# EAGLE design EXP_GameDuino_V1 (EAGLE 9.6.2)
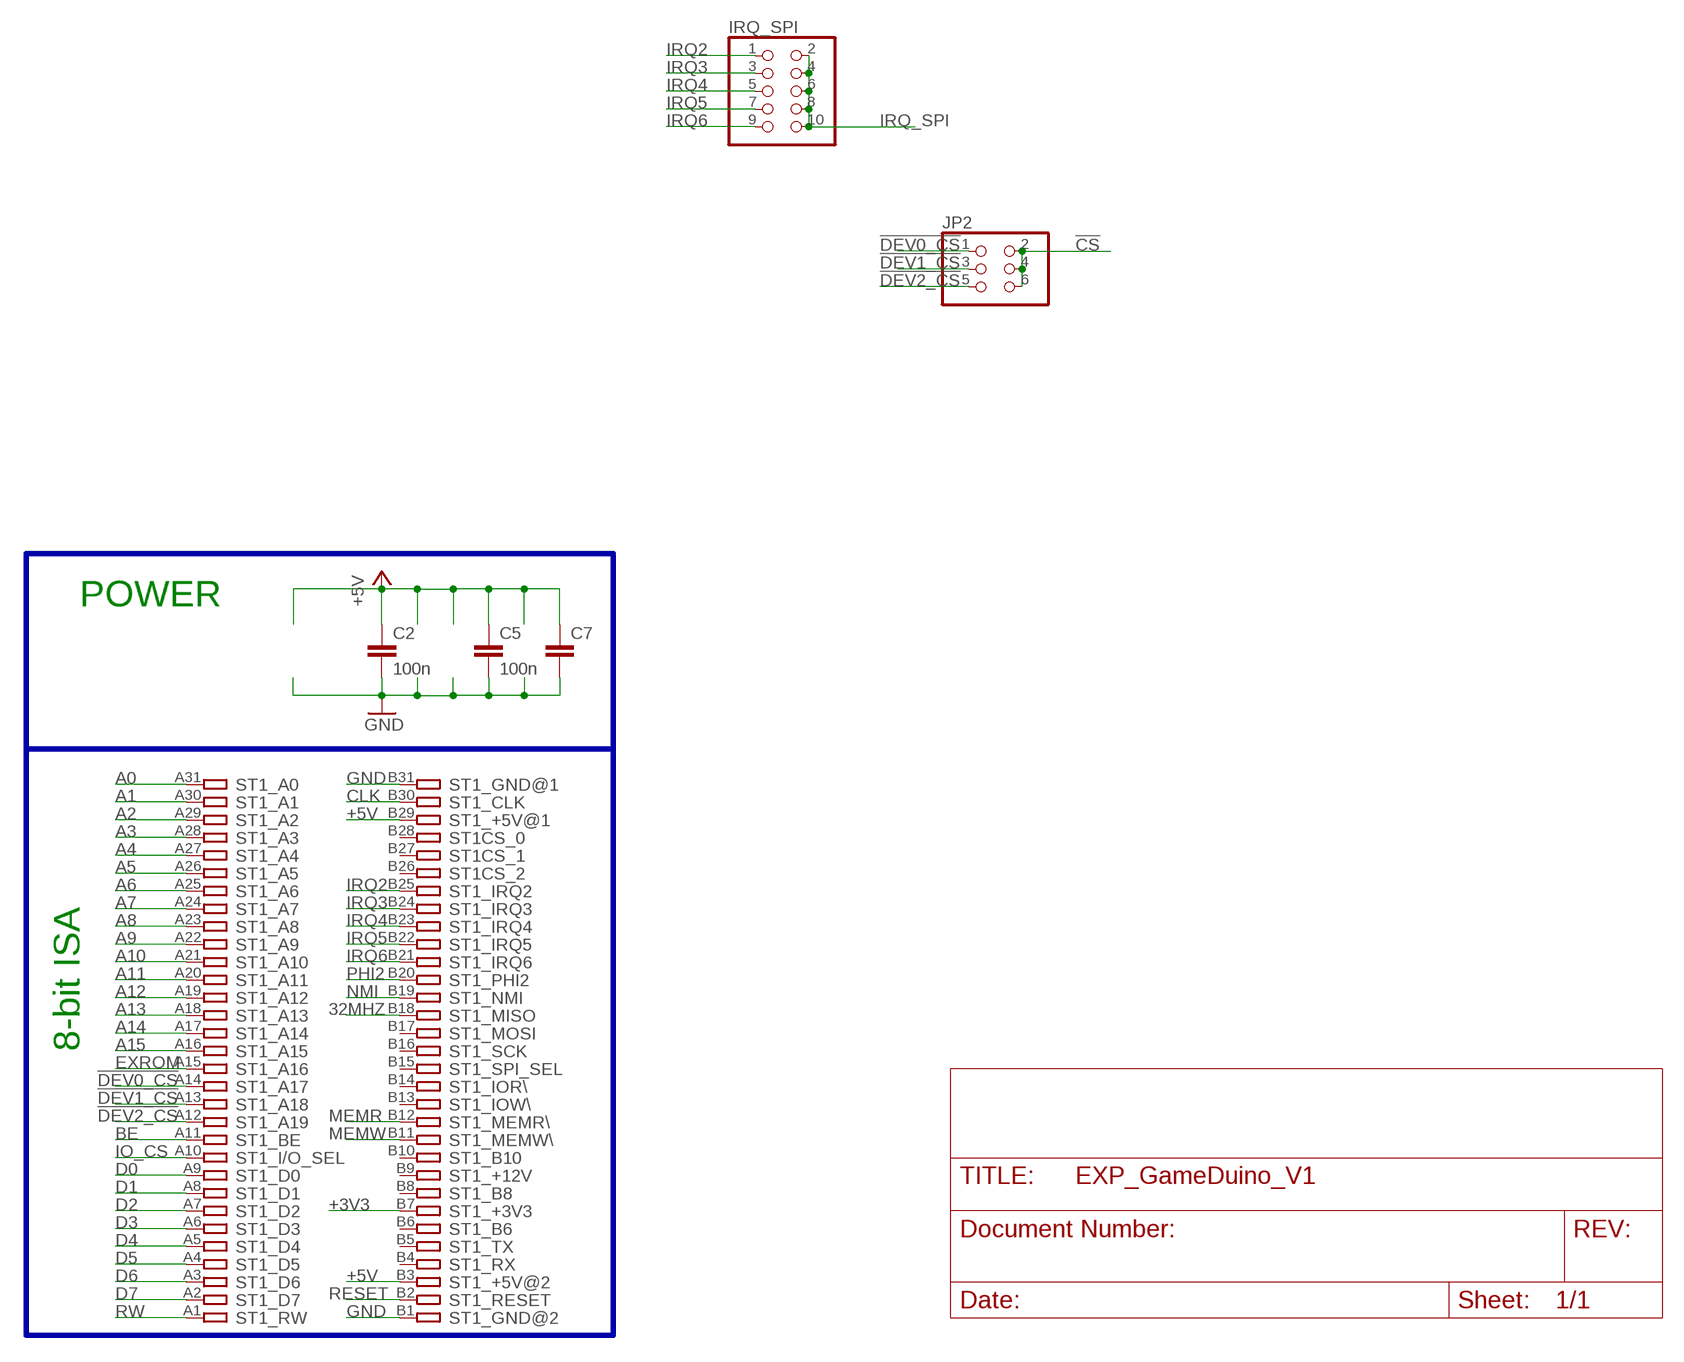
[diagram p0: schematic, sheet 1, part 1 of 2]
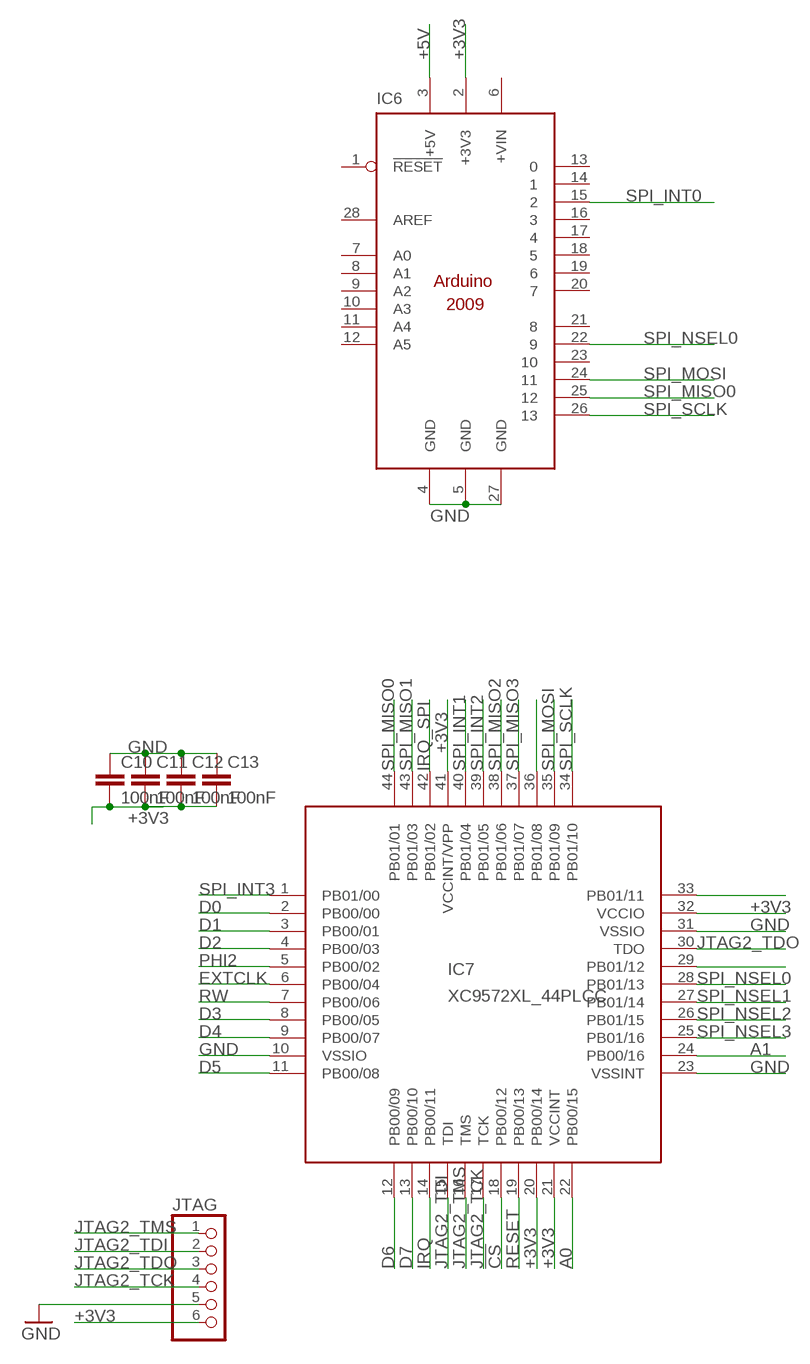
[diagram p1: schematic, sheet 1, part 2 of 2]

## Parts
C2  100n  C-EU050-025X075  [C050-025X075]
C5  100n  C-EU050-025X075  [C050-025X075]
C7  C-EU050-035X075  [C050-035X075]
C10  100nF  CAPC603  [C603]
C11  100nF  CAPC603  [C603]
C12  100nF  CAPC603  [C603]
C13  100nF  CAPC603  [C603]
IC6  ARDUINO2009_10  [ARDUINO2009]
IC7  XC9572XL_44PLCC  XC9536_44PLCCPLCC44_THT  [S44]
IRQ_SPI  PINHD-2X5  [2X05]
JP2  PINHD-2X3  [2X03]
JTAG  PINHD-1X6  [1X06]
ST1  IBM8BIT_ISASHORT  [APP_2X32_SHORT]

## Nets
32MHZ: ST1.B18
!CS: IC7.18(PB00/12) JP2.2 JP2.4 JP2.6
!DEV0_CS: JP2.1 ST1.A14
!DEV1_CS: JP2.3 ST1.A13
!DEV2_CS: JP2.5 ST1.A12
+3V3: C10.2 C11.2 C12.2 C13.2 IC6.2(+3V3) IC7.20(PB00/14) IC7.21(VCCINT) IC7.32(VCCIO) IC7.41(VCCINT/VPP) JTAG.6 ST1.B7
+5V [power]: C2.1 C5.1 C7.1 IC6.3(+5V) ST1.B3 ST1.B29
A0: IC7.22(PB00/15) ST1.A31
A1: IC7.24(PB00/16) ST1.A30
A2: ST1.A29
A3: ST1.A28
A4: ST1.A27
A5: ST1.A26
A6: ST1.A25
A7: ST1.A24
A8: ST1.A23
A9: ST1.A22
A10: ST1.A21
A11: ST1.A20
A12: ST1.A19
A13: ST1.A18
A14: ST1.A17
A15: ST1.A16
BE: ST1.A11
CLK: ST1.B30
D0: IC7.2(PB00/00) ST1.A9
D1: IC7.3(PB00/01) ST1.A8
D2: IC7.4(PB00/03) ST1.A7
D3: IC7.8(PB00/05) ST1.A6
D4: IC7.9(PB00/07) ST1.A5
D5: IC7.11(PB00/08) ST1.A4
D6: IC7.12(PB00/09) ST1.A3
D7: IC7.13(PB00/10) ST1.A2
EXROM: ST1.A15
EXTCLK: IC7.6(PB00/04)
GND [power]: C2.2 C5.2 C7.2 C10.1 C11.1 C12.1 C13.1 IC6.4(GND) IC6.5(GND) IC6.27(GND) IC7.10(VSSIO) IC7.23(VSSINT) IC7.31(VSSIO) JTAG.5 ST1.B1 ST1.B31
IO_CS: ST1.A10
IRQ: IC7.14(PB00/11)
IRQ2: IRQ_SPI.1 ST1.B25
IRQ3: IRQ_SPI.3 ST1.B24
IRQ4: IRQ_SPI.5 ST1.B23
IRQ5: IRQ_SPI.7 ST1.B22
IRQ6: IRQ_SPI.9 ST1.B21
IRQ_SPI: IC7.42(PB01/02) IRQ_SPI.2 IRQ_SPI.4 IRQ_SPI.6 IRQ_SPI.8 IRQ_SPI.10
JTAG2_TCK: IC7.17(TCK) JTAG.4
JTAG2_TDI: IC7.15(TDI) JTAG.2
JTAG2_TDO: IC7.30(TDO) JTAG.3
JTAG2_TMS: IC7.16(TMS) JTAG.1
MEMR: ST1.B12
MEMW: ST1.B11
N$29: IC7.29(PB01/12)
N$33: IC7.33(PB01/11)
N$36: IC7.36(PB01/08)
NMI: ST1.B19
PHI2: IC7.5(PB00/02) ST1.B20
RESET: IC7.19(PB00/13) ST1.B2
RW: IC7.7(PB00/06) ST1.A1
SPI_INT0: IC6.15
SPI_INT1: IC7.40(PB01/04)
SPI_INT2: IC7.39(PB01/05)
SPI_INT3: IC7.1(PB01/00)
SPI_MISO0: IC6.25 IC7.44(PB01/01)
SPI_MISO1: IC7.43(PB01/03)
SPI_MISO2: IC7.38(PB01/06)
SPI_MISO3: IC7.37(PB01/07)
SPI_MOSI: IC6.24 IC7.35(PB01/09)
SPI_NSEL0: IC6.22 IC7.28(PB01/13)
SPI_NSEL1: IC7.27(PB01/14)
SPI_NSEL2: IC7.26(PB01/15)
SPI_NSEL3: IC7.25(PB01/16)
SPI_SCLK: IC6.26 IC7.34(PB01/10)
Unconnected: IC6.1(!RESET) IC6.6(+VIN) IC6.7(A0) IC6.8(A1) IC6.9(A2) IC6.10(A3) IC6.11(A4) IC6.12(A5) IC6.13 IC6.14 IC6.16 IC6.17 IC6.18 IC6.19 IC6.20 IC6.21 IC6.23 IC6.28(AREF) ST1.B4 ST1.B5 ST1.B6 ST1.B8 ST1.B9 ST1.B10 ST1.B13 ST1.B14 ST1.B15 ST1.B16 ST1.B17 ST1.B26 ST1.B27 ST1.B28

## Buses
A8,A9,A10,A11,ACIA_CS,IO_CS,IO_CS_N,MOR

## Notes on the sheet
- POWER
- 8-bit ISA

## Library data of the parts
C2 C5 = rcl:C-EU: CAPACITOR, European symbol
C7 = rcl:C-EU: CAPACITOR, European symbol; SPICEPREFIX: C
C10-C13 = dp_devices:CAP
IC6 = arduino:ARDUINO2009_1: The Arduino Duemilanove ("2009") is a microcontroller board based on the ATmega168 or ATmega328. - 14 digital input/output pins (of which 6 can be used as PWM outputs) - 6 analog inputs, a 16 MHz crystal oscillator - USB connection - power jack - ISP header - reset button It contains everything needed to support the microcontroller; simply connect it to a computer with a USB cable or power it with a AC-to-DC adapter or battery to get started http://arduino.cc/en/Main/ArduinoBoardDuemilanove
IC7 = Xilinx_tirorin:XC9536_44PLCC: xc9536_pc44 XC9500 In-System Programmable CPLD Family Auto generated by make-symbol-device-package-bsdl.ulp Rev. 34 Source: xc9536_pc44.bsd
IRQ_SPI = pinhead:PINHD-2X5: PIN HEADER
JP2 = pinhead:PINHD-2X3: PIN HEADER
JTAG = pinhead:PINHD-1X6: PIN HEADER
ST1 = TiRoRiN_Libs:IBM8BIT_ISA: 8-bit CARD IBM/PC-AT

## Net classes
0 default: width 0.254 mm, drill 0.2 mm, clearance 0.254 mm
1 power: width 0.254 mm, drill 0.66 mm, clearance 0.254 mm to class 0, clearance 0.254 mm
2 data: width 0.254 mm, drill 0.66 mm, clearance 0.254 mm to class 0, clearance 0.254 mm to class 1, clearance 0.254 mm

## Board
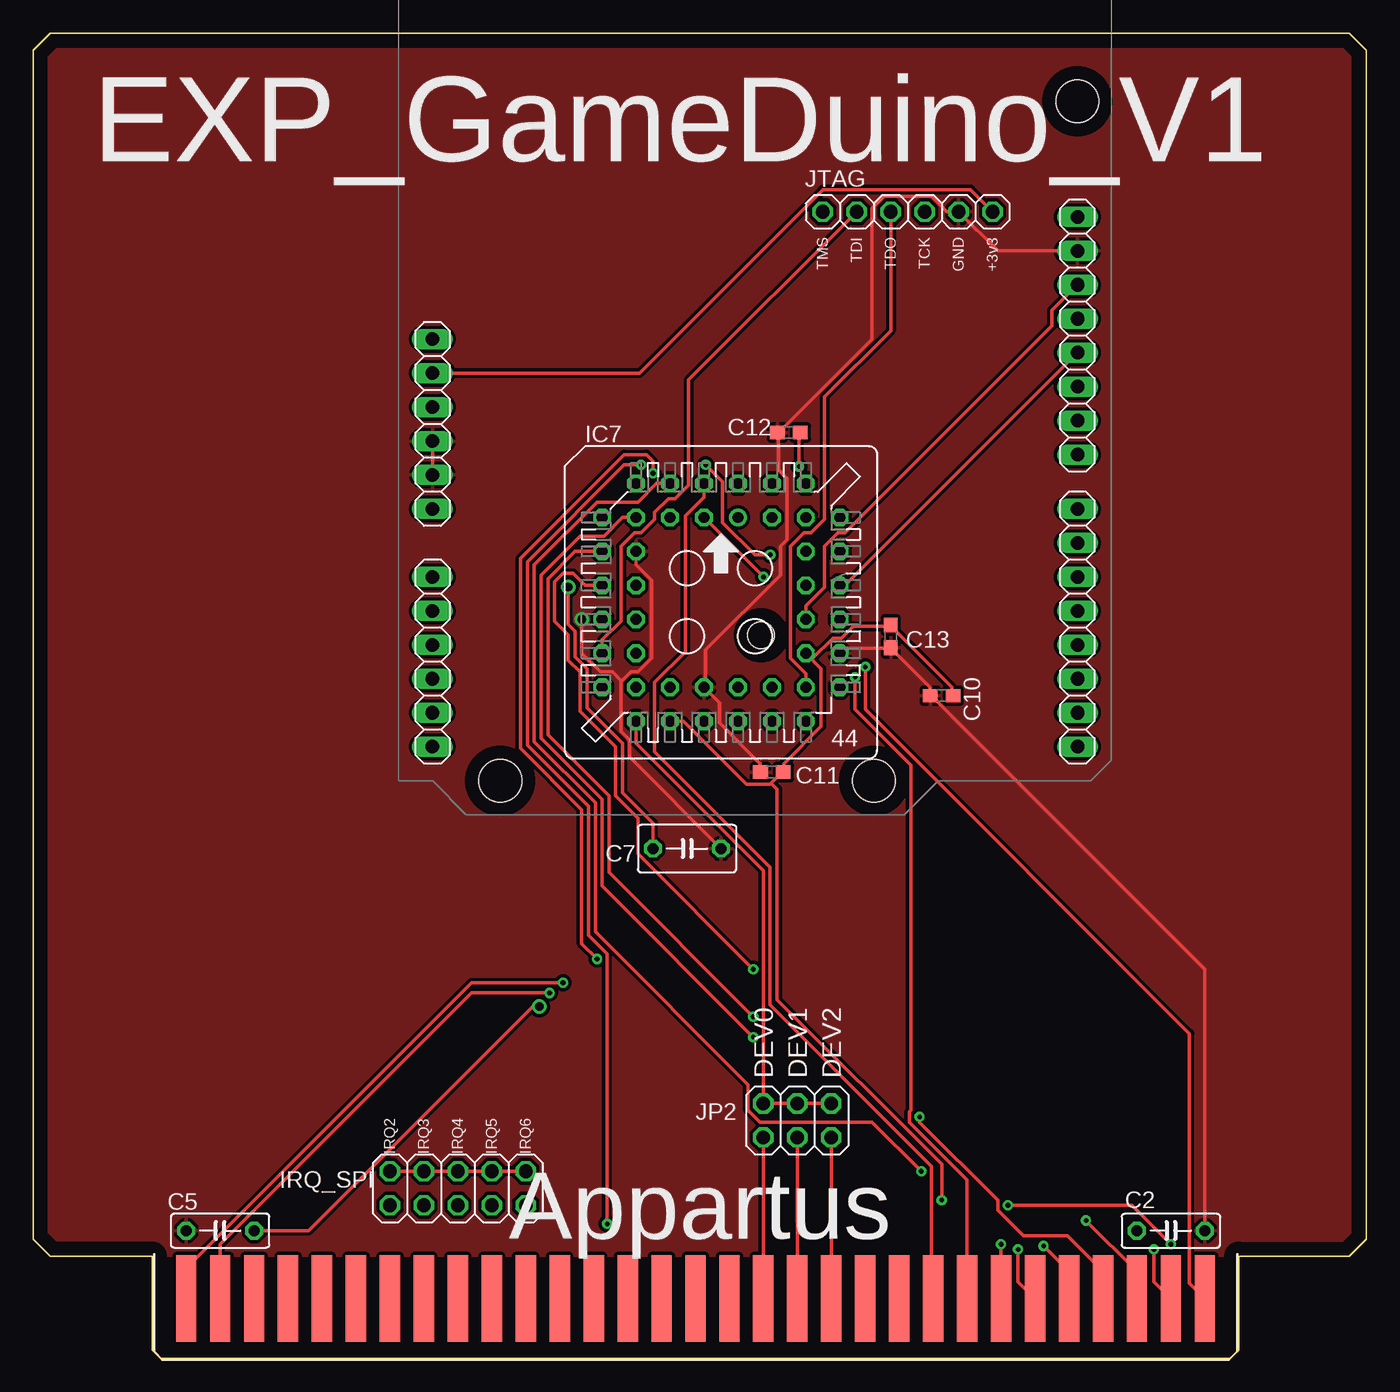
[diagram p2: board, top side]
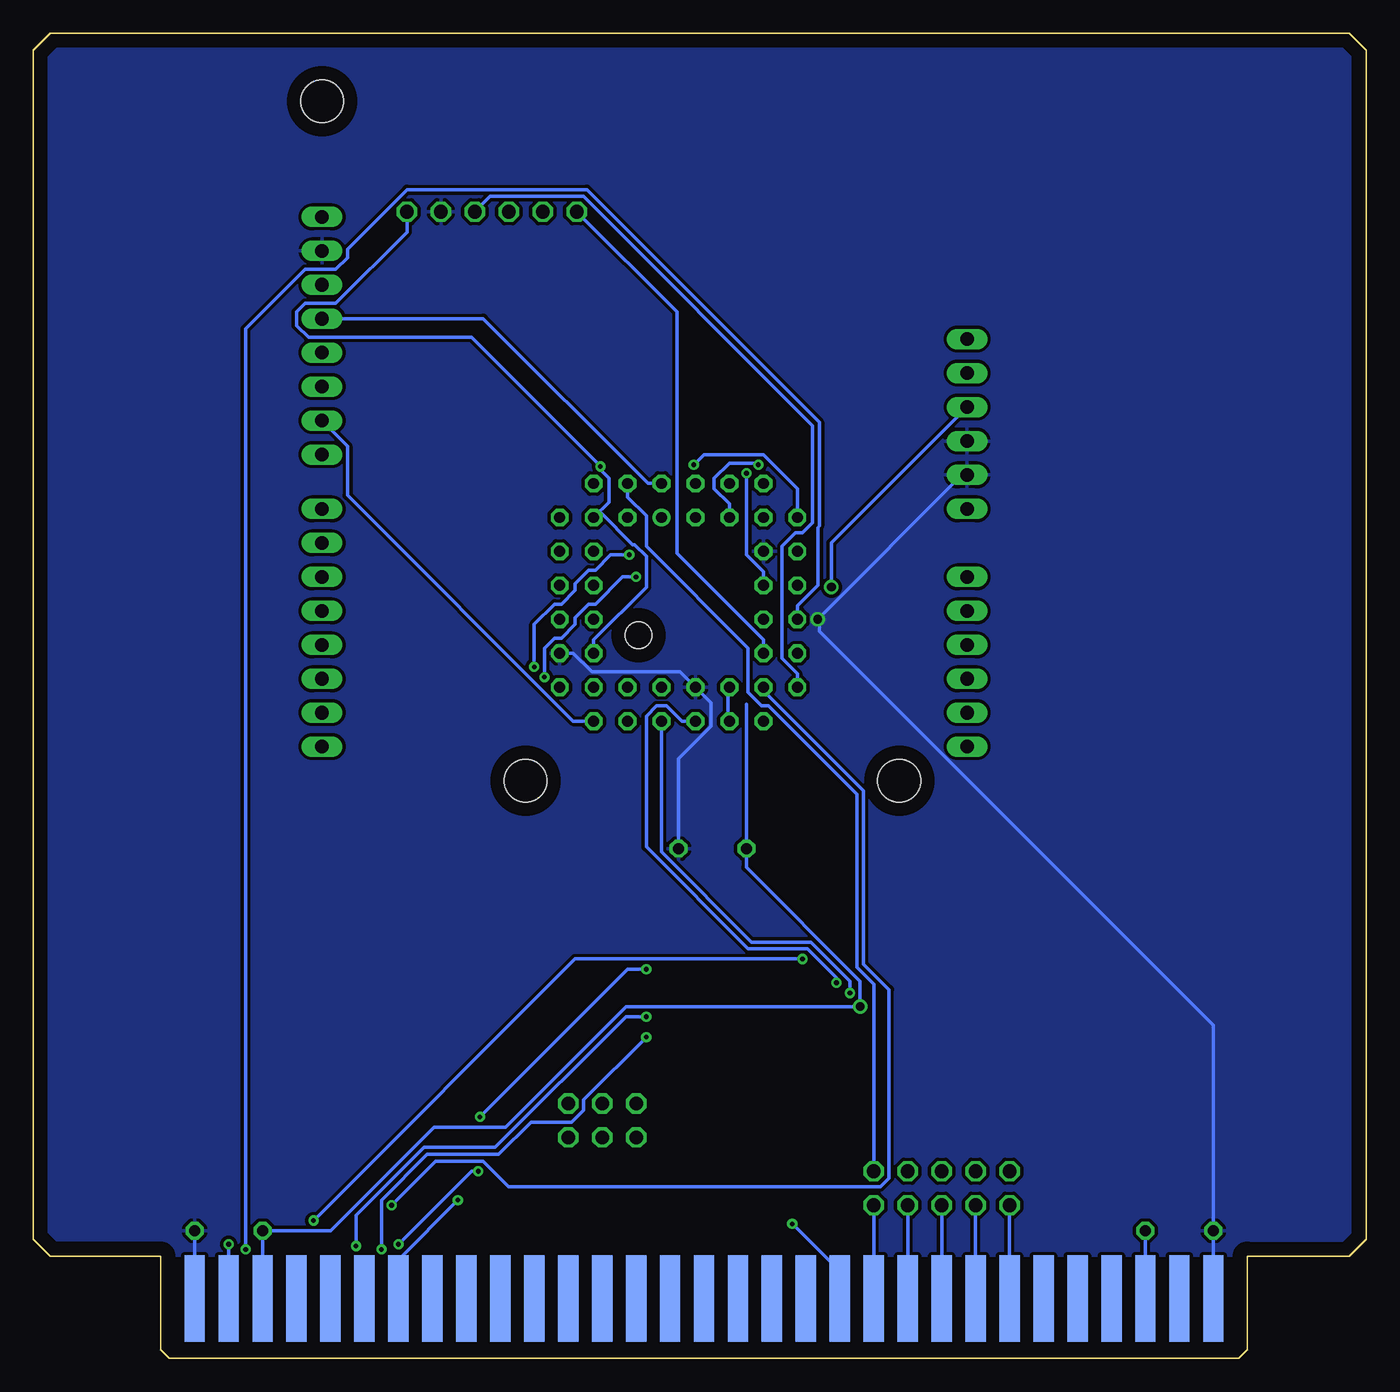
[diagram p3: board, bottom side, seen from below]

Size 99.7 x 99.06 mm. Coordinates in mm from the lower left corner, seen from the top.
Copper layers (1*16): Top 0.035mm / dielectric 1.5mm / Bottom 0.035mm
Design rules "appartus": minimum track width 6mil, minimum drill 0.35mm, track to track 6mil, track to pad 6mil, pad to pad 6mil, via to via 6mil, smd to smd 6mil, copper to edge 40mil, drill to drill 6mil, minimum pad ring 10mil, minimum via ring 8mil, stop-mask expansion 4mil, vias tented up to drill 0mil, thermal gap 10mil

### Footprints (pad centres in the part's own frame; a part is rotated, then mirrored left to right if it is on the bottom)
C050-025X075 = drill 0.813 octagon: 1 -2.54,0; 2 2.54,0
C050-035X075 = drill 0.813 octagon: 1 -2.54,0; 2 2.54,0
C603 = smd 1.1 x 1: 1 -0.85,0; 2 0.85,0
ARDUINO2009 = drill 1.016 long: 1 33.02,2.54; 2 35.56,2.54; 3 38.1,2.54; 4 40.64,2.54; 5 43.18,2.54; 6 45.72,2.54; 7 50.8,2.54; 8 53.34,2.54; 9 55.88,2.54; 10 58.42,2.54; 11 60.96,2.54; 12 63.5,2.54; 13 63.5,50.8; 14 60.96,50.8; 15 58.42,50.8; 16 55.88,50.8; 17 53.34,50.8; 18 50.8,50.8; 19 48.26,50.8; 20 45.72,50.8; 21 41.656,50.8; 22 39.116,50.8; 23 36.576,50.8; 24 34.036,50.8; 25 31.496,50.8; 26 28.956,50.8; 27 26.416,50.8; 28 23.876,50.8 | hole 3.2: 15.24,50.8; 66.04,35.56; 66.04,7.62 | hole 2: 55.17,27.114
S44 = drill 0.813: 1 1.27,6.35 | drill 0.813 octagon: 2 -1.27,8.89; 3 -1.27,6.35; 4 -3.81,8.89; 5 -3.81,6.35; 6 -6.35,8.89; 7 -8.89,6.35; 8 -6.35,6.35; 9 -8.89,3.81; 10 -6.35,3.81; 11 -8.89,1.27; 12 -6.35,1.27; 13 -8.89,-1.27; 14 -6.35,-1.27; 15 -8.89,-3.81; 16 -6.35,-3.81; 17 -8.89,-6.35; 18 -6.35,-8.89; 19 -6.35,-6.35; 20 -3.81,-8.89; 21 -3.81,-6.35; 22 -1.27,-8.89; 23 -1.27,-6.35; 24 1.27,-8.89; 25 1.27,-6.35; 26 3.81,-8.89; 27 3.81,-6.35; 28 6.35,-8.89; 29 8.89,-6.35; 30 6.35,-6.35; 31 8.89,-3.81; 32 6.35,-3.81; 33 8.89,-1.27; 34 6.35,-1.27; 35 8.89,1.27; 36 6.35,1.27; 37 8.89,3.81; 38 6.35,3.81; 39 8.89,6.35; 40 6.35,8.89; 41 6.35,6.35; 42 3.81,8.89; 43 3.81,6.35; 44 1.27,8.89
2X05 = drill 1.016 octagon: 1 -5.08,-1.27; 2 -5.08,1.27; 3 -2.54,-1.27; 4 -2.54,1.27; 5 0,-1.27; 6 0,1.27; 7 2.54,-1.27; 8 2.54,1.27; 9 5.08,-1.27; 10 5.08,1.27
2X03 = drill 1.016 octagon: 1 -2.54,-1.27; 2 -2.54,1.27; 3 0,-1.27; 4 0,1.27; 5 2.54,-1.27; 6 2.54,1.27
1X06 = drill 1.016 octagon: 1 -6.35,0; 2 -3.81,0; 3 -1.27,0; 4 1.27,0; 5 3.81,0; 6 6.35,0
APP_2X32_SHORT = smd 1.524 x 6.477: A1 38.1,-44.45; A2 35.56,-44.45; A3 33.02,-44.45; A4 30.48,-44.45; A5 27.94,-44.45; A6 25.4,-44.45; A7 22.86,-44.45; A8 20.32,-44.45; A9 17.78,-44.45; A10 15.24,-44.45; A11 12.7,-44.45; A12 10.16,-44.45; A13 7.62,-44.45; A14 5.08,-44.45; A15 2.54,-44.45; A16 0,-44.45; A17 -2.54,-44.45; A18 -5.08,-44.45; A19 -7.62,-44.45; A20 -10.16,-44.45; A21 -12.7,-44.45; A22 -15.24,-44.45; A23 -17.78,-44.45; A24 -20.32,-44.45; A25 -22.86,-44.45; A26 -25.4,-44.45; A27 -27.94,-44.45; A28 -30.48,-44.45; A29 -33.02,-44.45; A30 -35.56,-44.45; A31 -38.1,-44.45 | smd 1.524 x 6.477 bottom: B1 38.1,-44.45; B2 35.56,-44.45; B3 33.02,-44.45; B4 30.48,-44.45; B5 27.94,-44.45; B6 25.4,-44.45; B7 22.86,-44.45; B8 20.32,-44.45; B9 17.78,-44.45; B10 15.24,-44.45; B11 12.7,-44.45; B12 10.16,-44.45; B13 7.62,-44.45; B14 5.08,-44.45; B15 2.54,-44.45; B16 0,-44.45; B17 -2.54,-44.45; B18 -5.08,-44.45; B19 -7.62,-44.45; B20 -10.16,-44.45; B21 -12.7,-44.45; B22 -15.24,-44.45; B23 -17.78,-44.45; B24 -20.32,-44.45; B25 -22.86,-44.45; B26 -25.4,-44.45; B27 -27.94,-44.45; B28 -30.48,-44.45; B29 -33.02,-44.45; B30 -35.56,-44.45; B31 -38.1,-44.45

### Placement (x,y rotation side)
C2  85.09,9.53 0 top
C5  13.97,9.53 180 top
C7  48.9,38.1 0 top
C10  67.95,49.53 0 top
C11  55.25,43.82 0 top
C12  56.52,69.22 0 top
C13  64.14,53.98 90 top
IC6  27.31,109.22 270 top
IC7  51.44,56.52 0 top
IRQ_SPI  31.75,12.7 0 top
JP2  57.15,17.78 0 top
JTAG  65.41,85.73 0 top
ST1  49.53,48.9 0 top

### Tracks (layer width: path | path; a pad name or v marks a point on that pad's centre or on a via)
!CS
  Top 0.254: IC7.18 45.09,45.97 54.61,36.45 JP2.2 JP2.4 JP2.6
!DEV0_CS
  Top 0.254: ST1.A14 JP2.1
!DEV1_CS
  Top 0.254: ST1.A13 JP2.3
!DEV2_CS
  Top 0.254: ST1.A12 JP2.5
+3V3  (via drill 0.35)
  Top 0.254: IC6.2 45.34,73.66 59.06,87.38 70.1,87.38 JTAG.6 | v57.28,66.68 57.28,69.22 C12.2 | 64.14,54.74 61.34,54.74 60.45,53.85 59.82,53.85 58.29,52.32 IC7.32 58.93,51.56 58.93,47.24 56.13,44.45 56.13,43.82 C11.2 56.01,43.82 55.18,42.99 | 64.14,54.74 68.71,50.17 68.71,49.53 C10.2 | 64.14,54.74 C13.2 | IC7.20 48.64,47.63 53.34,42.93 55.12,42.93 55.18,42.99 | v67.95,11.81 67.95,14.48 55.63,26.8 55.63,42.55 55.18,42.99
  Bottom 0.254: IC7.32 57.79,53.72 53.85,57.66 53.85,59.94 54.74,60.83 54.86,60.83 57.28,63.25 IC7.41 56.64,64.01 56.64,65.79 57.28,66.42 v57.28,66.68 66.93,76.33 79.12,76.33 80.01,77.22 80.01,78.23 79.38,78.87 77.09,78.87 71.76,84.2 JTAG.6 | ST1.B7 72.39,7.37 v67.95,11.81 | IC7.21 47.73,49.99 47.73,47.74 IC7.20
+5V  (via drill 0.66)
  Top 0.254: v40.01,57.66 40.01,54.86 40.51,54.36 40.51,52.45 41.4,51.56 41.4,48.64 44.07,45.97 44.07,42.29 46.36,40.01 C7.1 | C5.1 20.57,9.53 37.34,26.29 v37.85,26.29
  Bottom 0.254: ST1.B3 C2.1 77.47,9.53 69.72,17.27 64.39,17.27 55.37,26.29 v37.85,26.29 37.85,28.19 46.36,36.7 C7.1 46.36,48.9 | ST1.B29 C5.1 | IC6.3 40.01,60.96 v40.01,57.66
A0  (via drill 0.35)
  Top 0.254: v39.62,28.07 32.77,28.07 11.43,6.73 ST1.A31
  Bottom 0.254: IC7.22 51.18,47.63 52.32,48.77 53.09,48.77 53.85,48.01 53.85,38.23 46.23,30.61 41.78,30.61 39.62,28.45 v39.62,28.07
A1  (via drill 0.35)
  Top 0.254: v38.61,27.31 32.77,27.31 13.97,8.51 ST1.A30
  Bottom 0.254: IC7.24 52.71,37.85 45.97,31.12 41.53,31.12 38.61,28.19 v38.61,27.31
D0
  Top 0.254: IC7.2 50.17,64.39 48.77,62.99 48.77,52.83 46.48,50.55 46.48,45.34 55.12,36.7 55.12,26.42 67.18,14.35 67.18,4.57 ST1.A9
D1  (via drill 0.35)
  Top 0.254: v54.61,58.42 IC7.3 | v61.47,50.93 61.47,48.51 65.66,44.32 65.66,18.54 65.53,18.42 65.53,17.65 69.85,13.34 ST1.A8
  Bottom 0.254: v54.61,58.42 55.63,58.42 57.66,56.39 58.17,56.39 59.18,55.37 59.18,54.86 60.2,53.85 60.71,53.85 61.47,53.09 v61.47,50.93
D2  (via drill 0.35)
  Top 0.254: IC7.4 46.61,65.41 45.21,64.01 42.16,64.01 37.47,59.31 37.47,46.1 42.04,41.53 42.04,31.88 53.47,20.45 53.47,18.54 54.36,17.65 62.74,17.65 v66.42,13.97 | ST1.A7 v72.39,8.51
  Bottom 0.254: v66.42,13.97 66.93,13.97 v72.39,8.51
D3  (via drill 0.35)
  Top 0.254: IC7.8 44.07,62.87 42.67,61.47 40.89,61.47 37.97,58.55 37.97,46.36 42.55,41.78 42.55,35.31 v53.85,24 | v73.66,8.13 73.66,5.72 ST1.A6
  Bottom 0.254: v53.85,24 58.55,19.3 58.55,18.54 59.44,17.65 62.48,17.65 64.9,15.24 70.23,15.24 73.66,11.81 v73.66,8.13
D4  (via drill 0.35)
  Top 0.254: IC7.9 40.51,60.33 38.48,58.29 38.48,46.61 43.05,42.04 43.05,36.32 v53.85,25.53 | v75.56,8.38 77.47,6.48 ST1.A5
  Bottom 0.254: v53.85,25.53 55.37,25.53 65.15,15.75 70.48,15.75 75.56,10.67 v75.56,8.38
D5  (via drill 0.35)
  Top 0.254: IC7.11 41.28,57.79 40.39,58.67 39.62,58.67 38.99,58.04 38.99,55.12 40.01,54.1 40.01,52.2 40.89,51.31 40.89,48.39 43.56,45.72 43.56,42.04 45.21,40.39 45.21,37.72 v53.85,29.08 | v66.29,18.03 66.29,17.65 72.14,11.81 72.14,11.05 74.04,9.14 77.34,9.14 80.01,6.48 ST1.A4
  Bottom 0.254: v53.85,29.08 55.25,29.08 v66.29,18.03
D6  (via drill 0.35)
  Top 0.254: v46.36,66.17 46.36,67.06 45.85,67.56 44.2,67.56 36.45,59.82 36.45,45.59 41.02,41.02 41.02,30.99 v42.16,29.85 | v78.74,10.29 82.55,6.48 ST1.A3
  Bottom 0.254: IC7.12 45.09,58.8 46.36,60.07 v46.36,66.17 | v42.16,29.85 59.18,29.85 v78.74,10.29
D7  (via drill 0.35)
  Top 0.254: v83.82,8.13 83.82,5.72 ST1.A2
  Bottom 0.254: IC7.13 42.55,56.26 41.02,57.79 41.02,62.1 40.89,62.23 40.89,69.98 58.29,87.38 71.76,87.38 76.2,82.93 76.2,82.3 77.09,81.41 79.38,81.41 83.82,76.96 v83.82,8.13
GND  (via drill 0.66)
  Top 0.254: IC6.27 72.14,82.8 JTAG.5 68.33,85.73 67.18,86.87 63.63,86.87 62.74,85.98 62.74,76.2 55.75,69.22 | 64.14,53.09 60.71,53.09 IC7.31 | 64.14,53.09 67.06,50.17 67.06,49.53 C10.1 67.18,49.53 87.63,29.08 C2.2 | 64.14,53.09 C13.1 | IC6.4 IC6.5 | C11.1 54.36,43.82 54.36,44.45 51.31,47.5 51.31,49.02 IC7.23 50.29,50.17 50.29,52.96 55.88,58.55 55.88,60.71 56.39,61.21 56.39,65.79 55.75,66.42 55.75,69.22 | IC7.10 45.09,59.31 46.23,58.17 46.23,52.32 45.21,51.31 44.7,51.31 44.01,50.61 | 44.01,50.61 43.94,50.55 43.94,46.86 44.58,46.23 44.58,44.96 C7.2 | v41.02,55.25 41.02,52.71 42.42,51.31 43.31,51.31 44.01,50.61 | 55.75,69.22 C12.1
  Bottom 0.254: ST1.B1 C2.2 | ST1.B31 C5.2 11.43,24.89 40.89,54.36 40.89,55.25 v41.02,55.25 30.23,66.04 IC6.5 | C7.2 51.44,44.83 49.02,47.24 49.02,49.02 IC7.23 51.31,51.31 57.91,51.31 59.31,52.71 IC7.31
  pour Top: -3.81,104.14 106.68,104.14 106.68,7.62 -3.81,7.62
  pour Bottom: 103.51,101.6 -6.98,101.6 -6.98,7.62 103.51,7.62
IRQ2
  Bottom 0.254: ST1.B25 IRQ_SPI.1
IRQ3
  Bottom 0.254: ST1.B24 IRQ_SPI.3
IRQ4
  Bottom 0.254: ST1.B23 IRQ_SPI.5
IRQ5
  Bottom 0.254: ST1.B22 IRQ_SPI.7
IRQ6
  Bottom 0.254: ST1.B21 IRQ_SPI.9
IRQ_SPI
  Top 0.254: IRQ_SPI.2 IRQ_SPI.4 IRQ_SPI.6 IRQ_SPI.8 IRQ_SPI.10
  Bottom 0.254: IC7.42 55.25,64.39 53.85,62.99 53.85,60.71 46.23,53.09 46.23,49.78 45.21,48.77 44.7,48.77 38.1,42.16 38.1,29.21 36.83,27.94 IRQ_SPI.10
JTAG2_TCK
  Bottom 0.254: IC7.17 42.55,51.18 43.69,52.32 43.69,60.71 42.67,61.72 42.16,61.72 41.4,62.48 41.4,69.72 58.55,86.87 65.53,86.87 JTAG.4
JTAG2_TDI
  Top 0.254: IC7.15 42.55,53.72 43.94,55.12 43.94,60.71 44.96,61.72 45.47,61.72 46.48,62.74 46.48,63.25 47.5,64.26 48.01,64.26 49.02,65.28 49.02,73.15 JTAG.2
JTAG2_TDO
  Top 0.254: IC7.30 57.79,51.18 56.64,52.32 56.64,60.71 57.66,61.72 58.17,61.72 59.18,62.74 59.18,71.88 64.14,76.84 JTAG.3
JTAG2_TMS
  Bottom 0.254: IC7.16 45.09,53.72 51.56,60.2 51.56,78.23 JTAG.1
PHI2  (via drill 0.35)
  Top 0.254: v45.47,66.8 44.2,66.8 36.96,59.56 36.96,45.85 41.53,41.28 41.53,31.62 42.93,30.23 v42.93,10.03
  Bottom 0.254: IC7.5 47.63,63.88 48.77,65.02 48.77,65.79 47.63,66.93 45.59,66.93 v45.47,66.8 | v42.93,10.03 39.37,6.48 ST1.B20
RESET  (via drill 0.35)
  Top 0.254: v72.9,11.43 82.17,11.43 v85.09,8.51
  Bottom 0.254: IC7.19 45.09,49.91 37.59,42.42 37.59,29.46 35.69,27.56 35.69,13.46 36.32,12.83 64.14,12.83 66.04,14.73 69.6,14.73 v72.9,11.43 | ST1.B2 v85.09,8.51
RW  (via drill 0.35)
  Top 0.254: v50.29,66.8 51.56,65.53 51.56,62.48 53.98,60.07 v55.12,60.07 | v62.23,51.69 62.23,48.51 86.49,24.26 86.49,5.59 ST1.A1
  Bottom 0.254: IC7.7 42.55,65.02 45.09,67.56 49.53,67.56 v50.29,66.8 | v55.12,60.07 56.52,60.07 57.66,58.93 58.17,58.93 59.18,57.91 59.18,57.4 60.2,56.39 60.71,56.39 62.23,54.86 v62.23,51.69
SPI_MISO0
  Bottom 0.254: IC7.44 53.72,65.41 66.04,77.72 IC6.25
SPI_MOSI
  Top 0.254: IC7.35 60.71,57.79 IC6.24
SPI_NSEL0
  Bottom 0.254: IC7.28 59.31,47.63 76.2,64.52 76.2,68.2 IC6.22
SPI_SCLK
  Top 0.254: IC7.34 57.79,56.26 59.18,57.66 59.18,60.71 60.2,61.72 60.71,61.72 76.2,77.22 76.2,78.36 IC6.26

### Text on the board
tNames: EXP_GameDuino_V1 | TMS | TDI | TDO | TCK | GND | +3v3 | DEV0 | DEV1 | DEV2 | IRQ2 | IRQ3 | IRQ4 | IRQ5 | IRQ6